# EAGLE design USB (EAGLE 8.0.0)
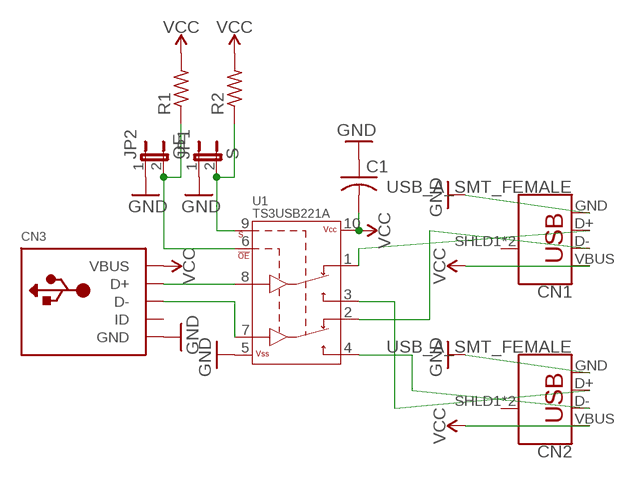
[diagram p0: schematic, sheet 1]

## Parts
C1  C-USC0402K  [C0402K]
CN1  USB_A_SMT_FEMALE  [USB-A-S-SILK-FEMALE]
CN2  USB_A_SMT_FEMALE  [USB-A-S-SILK-FEMALE]
CN3  USBMINIB  [USB-MINIB]
JP1  S  JUMPER-2PTH  [1X02]
JP2  OE  JUMPER-2PTH  [1X02]
R1  R-US_R0402  [R0402]
R2  R-US_R0402  [R0402]
U1  TS3USB221A  [QFN-10-RSE]

## Nets
GND: C1.1 CN1.GND CN2.GND CN3.GND JP1.1 JP2.1 U1.5(VSS)
N$1: CN3.D+ U1.8(D+)
N$2: CN3.D- U1.7(D-)
N$3: CN1.D+ U1.1(1D+)
N$4: CN2.D+ U1.3(2D+)
N$5: CN1.D- U1.2(1D-)
N$6: CN2.D- U1.4(2D-)
N$7: JP2.2 R1.1 U1.6(!OE)
N$8: JP1.2 R2.1 U1.9(S)
VCC: C1.2 CN1.VBUS CN2.VBUS CN3.VBUS R1.2 R2.2 U1.10(VCC)
Unconnected: CN1.SHLD1(SHIELD) CN1.SHLD2(SHIELD) CN2.SHLD1(SHIELD) CN2.SHLD2(SHIELD) CN3.ID

## Library data of the parts
C1 = adafruit:C-US: CAPACITOR, American symbol
CN1 CN2 = SparkFun-Connectors:USB_A: USB-A Connector Male and female variants, as well as PTH and SMT variants SparkFun Products: SparkFun XBee Explorer Dongle <https://www.sparkfun.com/products/11697> PTH Male SparkFun MicroView-USB Programmer <https://www.sparkfun.com/products/12924> SMT Male SparkFun USB Type A Female Breakout <https://www.sparkfun.com/products/12700> SMT Female; PROD_ID: CONN-09520; SF_ID: PRT-09011
CN3 = adafruit:USB: USB Connectors USBMINIB - Surface Mount Female Mini-B USB Connector 4UConnector: 06564 By microbuilder.eu Thru-hole RA Female Mini-B USB Connector 4UConnector: 18732 By ladyada.net
JP1 JP2 = SparkFun-Retired:JUMPER-2: Jumper Basic 0.1" spaced jumper. Use with breakaway headers.
R1 R2 = adafruit:R-US_: RESISTOR, American symbol
U1 = SparkFun-IC-Special-Function:TS3USB221A: DPDT Analog Mux DPDT Analog Mux Vcc 2.5 to 3.3V Passes up to 5.5V at 3.3V supply 900MHz BW, 6Ω switch resistance SparkFun Products SparkFun FTDI SmartBasic <https://www.sparkfun.com/products/12935> (DEV-12935); PROD_ID: IC-12115

## Board
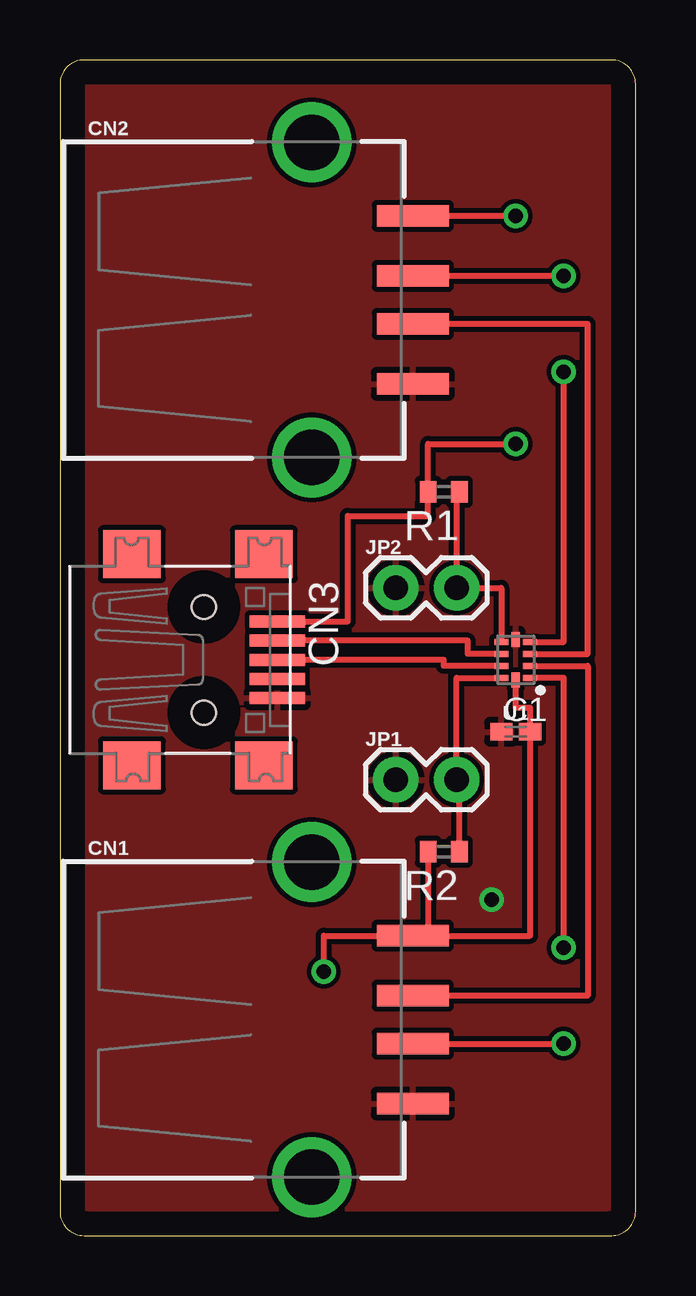
[diagram p1: board, top side]
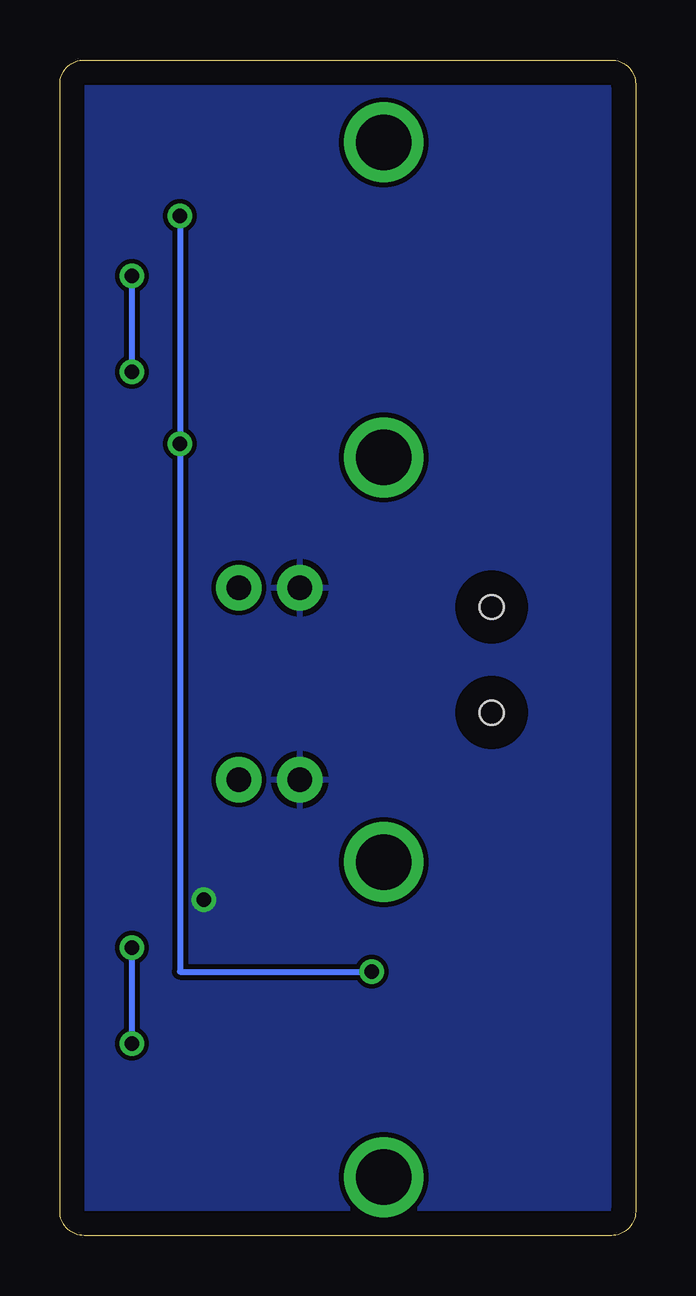
[diagram p2: board, bottom side, seen from below]

Size 24 x 49 mm. Coordinates in mm from the lower left corner, seen from the top.
Outline: 0,48 0,1 arc90 1,0 23,0 arc90 24,1 24,48 arc90 23,49 1,49 arc90 0,48
Copper layers (1*16): Top 0.035mm / dielectric 1.5mm / Bottom 0.035mm
Design rules "default": minimum track width 10mil, minimum drill 24mil, track to track 8mil, track to pad 8mil, pad to pad 8mil, via to via 8mil, smd to smd 8mil, copper to edge 40mil, drill to drill 8mil, minimum pad ring 10mil, minimum via ring 8mil, stop-mask expansion 4mil, vias tented up to drill 0mil, thermal gap 10mil

### Footprints (pad centres in the part's own frame; a part is rotated, then mirrored left to right if it is on the bottom)
C0402K = smd 0.925 x 0.74: 1 -0.6,0; 2 0.6,0
USB-A-S-SILK-FEMALE = smd 3 x 0.9: D+ 7.212,-1; D- 7.212,1; GND 7.212,-3.5; VBUS 7.212,3.5 | drill 2.311: SHLD1 3,-6.566; SHLD2 3,6.566
USB-MINIB = smd 0.5 x 2.308: D+ 0,4.064; D- -0.8,4.064; GND 1.6,4.064; ID 0.8,4.064; VBUS -1.6,4.064 | smd 2 x 2.4: GND1 -4.4,-2; GND2 -4.4,3.5; GND3 4.4,3.5; GND4 4.4,-2 | hole 1: -2.2,1; 2.2,1
1X02 = drill 1.016 pad 1.88: 1 0,0; 2 2.54,0
R0402 = smd 0.7 x 0.9: 1 -0.65,0; 2 0.65,0
QFN-10-RSE = smd 0.58 x 0.25: 1 -0.6,0.75; 2 -0.6,0.25; 3 -0.6,-0.25; 4 -0.6,-0.75; 6 0.6,-0.75; 7 0.6,-0.25; 8 0.6,0.25; 9 0.6,0.75 | smd 0.35 x 0.63: 5 0,-0.85; 10 0,0.85

### Placement (x,y rotation side)
C1  19,21 0 top
CN1  7.5,9 0 top
CN2  7.5,39 0 top
CN3  5,24 270 top
JP1  14,19 0 top
JP2  14,27 0 top
R1  16,31 180 top
R2  16,16 180 top
U1  19,24 180 top

### Tracks (layer width: path | path; a pad name or v marks a point on that pad's centre or on a via)
GND  (via drill 0.6)
  other vias: 18,14
  pour Bottom: 23,0 1,0 arc-90 0,1 0,48 arc-90 1,49 23,49 arc-90 24,48 24,1 arc-90
  pour Top: 23,0 1,0 arc-90 0,1 0,48 arc-90 1,49 23,49 arc-90 24,48 24,1 arc-90
N$1
  Top 0.254: U1.8 16,23.75 16,24 CN3.D+
N$2
  Top 0.254: CN3.D- 17,24.8 17,24.25 U1.7
N$3  (via drill 0.6)
  Top 0.254: v21,12 21,23.25 U1.1 | CN1.D+ v21,8
  Bottom 0.254: v21,8 v21,12
N$4
  Top 0.254: U1.3 22,24.25 22,38 CN2.D+
N$5
  Top 0.254: U1.2 22,23.75 22,10 CN1.D-
N$6  (via drill 0.6)
  Top 0.254: U1.4 21,24.75 v21,36 | v21,40 CN2.D-
  Bottom 0.254: v21,36 v21,40
N$7
  Top 0.254: U1.6 18.4,27 JP2.2 16.54,31 R1.1
N$8
  Top 0.254: U1.9 16.54,23.25 JP1.2 16.65,19 R2.1
VCC  (via drill 0.6)
  Top 0.254: CN3.VBUS 12,25.6 12,30 15.35,30 R1.2 15.35,33 v19,33 | U1.10 19,22 19.6,22 C1.2 19.6,12.5 CN1.VBUS | R2.2 15.35,12.5 CN1.VBUS | v19,42.5 CN2.VBUS | v11,11 11,12.5 CN1.VBUS
  Bottom 0.254: v19,42.5 v19,33 19,11 v11,11